# Altium schematic sheet Motor Control - Phase C.SchDoc: [11] Motor Control - Phase C
size A4; ApprovedBy: Nagy Richard; CheckedBy: Nagy Richard; Author: Nagy Richard; CompanyName: EmbedCore; DrawnBy: Nagy Richard; Engineer: Nagy Richard; Organization: EmbedCore; Revision: 1.0; SheetNumber: 11; SheetTotal: 25
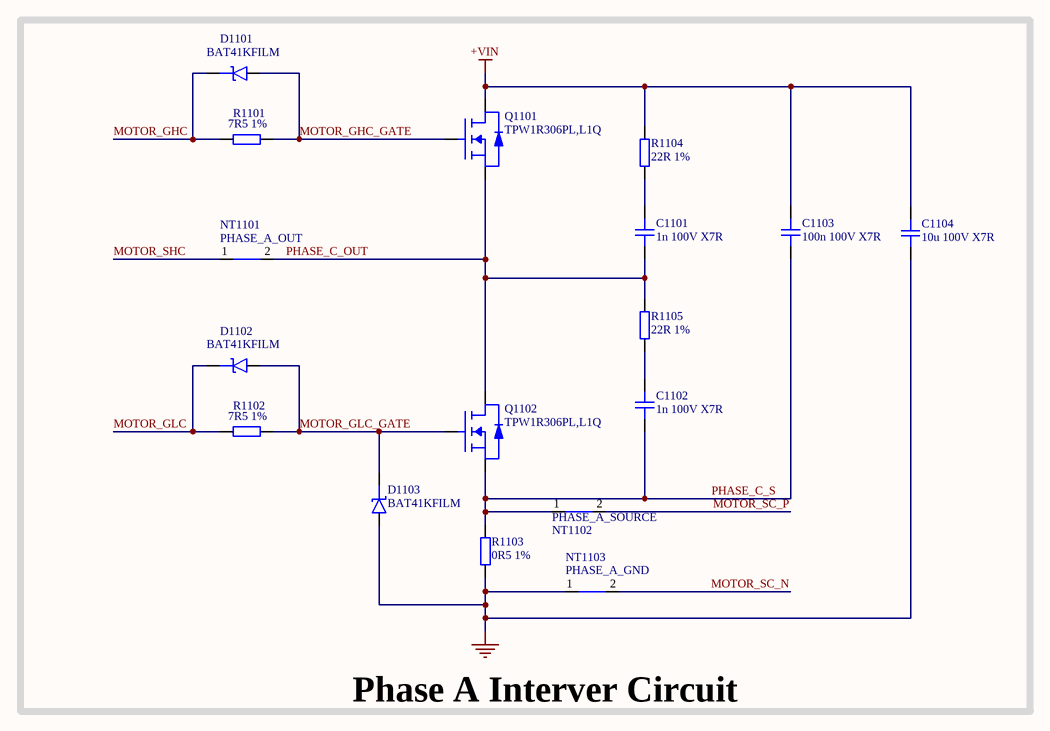
[diagram p0: Motor Control - Phase C.SchDoc]

## Parts
C1101  1n 100V X7R  [CAP_0805]
C1102  1n 100V X7R  [CAP_0805]
C1103  100n 100V X7R  [CAP_1206]
C1104  10u 100V X7R  [CAP_1210]
D1101  BAT41KFILM  [SOD-523]
D1102  BAT41KFILM  [SOD-523]
D1103  BAT41KFILM  [SOD-523]
NT1101  PHASE_A_OUT  [NETTIE_SMD]  (net tie, no BOM)
NT1102  PHASE_A_SOURCE  [NETTIE_SMD]  (net tie, no BOM)
NT1103  PHASE_A_GND  [NETTIE_SMD]  (net tie, no BOM)
Q1101  TPW1R306PL,L1Q  [PowerPAK-SO-8]
Q1102  TPW1R306PL,L1Q  [PowerPAK-SO-8]
R1101  7R5 1%  [RES_0603]
R1102  7R5 1%  [RES_0603]
R1103  0R5 1%  [RES_1206]
R1104  22R 1%  [RES_0805]
R1105  22R 1%  [RES_0805]

## Blocks framed on the sheet
Phase A Interver Circuit: C1101-C1104 D1101-D1103 NT1101-NT1103 Q1101 Q1102 R1101-R1105

## Nets
+VIN: C1103.2 C1104.2 Q1101.D R1104.2
GND: C1104.1 D1103.A NT1103.1 R1103.1
MOTOR_GHC: D1101.K R1101.1
MOTOR_GHC_GATE: D1101.A Q1101.G R1101.2
MOTOR_GLC: D1102.K R1102.1
MOTOR_GLC_GATE: D1102.A D1103.K Q1102.G R1102.2
MOTOR_SC_N: NT1103.2
MOTOR_SC_P: NT1102.2
MOTOR_SHC: NT1101.1
PHASE_C_OUT: C1101.1 NT1101.2 Q1101.S Q1102.D R1105.2
PHASE_C_S: C1102.1 C1103.1 NT1102.1 Q1102.S R1103.2
NetC1101_2: C1101.2 R1104.1
NetC1102_2: C1102.2 R1105.1

## Notes on the sheet
- Title:
- Drawn By:
- Page Contents:
- Checked By:
- Size:
- Date:
- File:
- License:
- Email:
- A4
- Number:
- Time:
- Revision:
- Sheet
- Website:
- of

## Library data of the parts
C1101 C1102 = CAP_0805: Capacitor SMD 0805; Manufacturer: Kyocera AVX; Manufacturer Part Number: 08051C102JAT2A; Distributor Link: www.lcsc.com; LCSC: C2169492; Rating: *; Dielectric: *
C1103 = CAP_1206: Capacitor SMD 1206; Manufacturer: YAGEO; Manufacturer Part Number: CC1206JKX7R0BB104; Distributor Link: www.lcsc.com; LCSC: C726629; Rating: *; Dielectric: *
C1104 = CAP_1210: Capacitor SMD 1210; Manufacturer: PSA(Prosperity Dielectrics); Manufacturer Part Number: FS32X106K101EGG; Distributor Link: www.lcsc.com; LCSC: C5156756; Rating: *; Dielectric: *
D1101-D1103 = D_SCHOTTKY_SOD_523: Diode Schottky SMD SOD-323; Manufacturer: STMicroelectronics; Manufacturer Part Number: BAT41KFILM; LCSC: C73150
NT1101-NT1103 = NetTie_SMD: Net Tie SMD
Q1101 Q1102 = SIR500DP-T1-RE3: MOSFET N-Channel Vds=30V Id=351A Rds=470uR; Manufacturer: Vishay; Manufacturer Part Number: SIR500DP-T1-RE3
R1101 R1102 = RES_0603: Resistor SMD 0603; Manufacturer: PANASONIC; Manufacturer Part Number: ERJPA3J7R5V; Distributor Link: www.lcsc.com; LCSC: C445790
R1103 = RES_1206: Resistor SMD 1206; Manufacturer: Milliohm; Manufacturer Part Number: HoSRX1206-3W-0.5mR-1%; Distributor Link: www.lcsc.com; LCSC: C18724161
R1104 R1105 = RES_0805: Resistor SMD 0805; Manufacturer: Viking Tech; Manufacturer Part Number: ARG05FTC0220; Distributor Link: www.lcsc.com; LCSC: C218436